# EAGLE design PI_HAT (EAGLE 9.7.0)
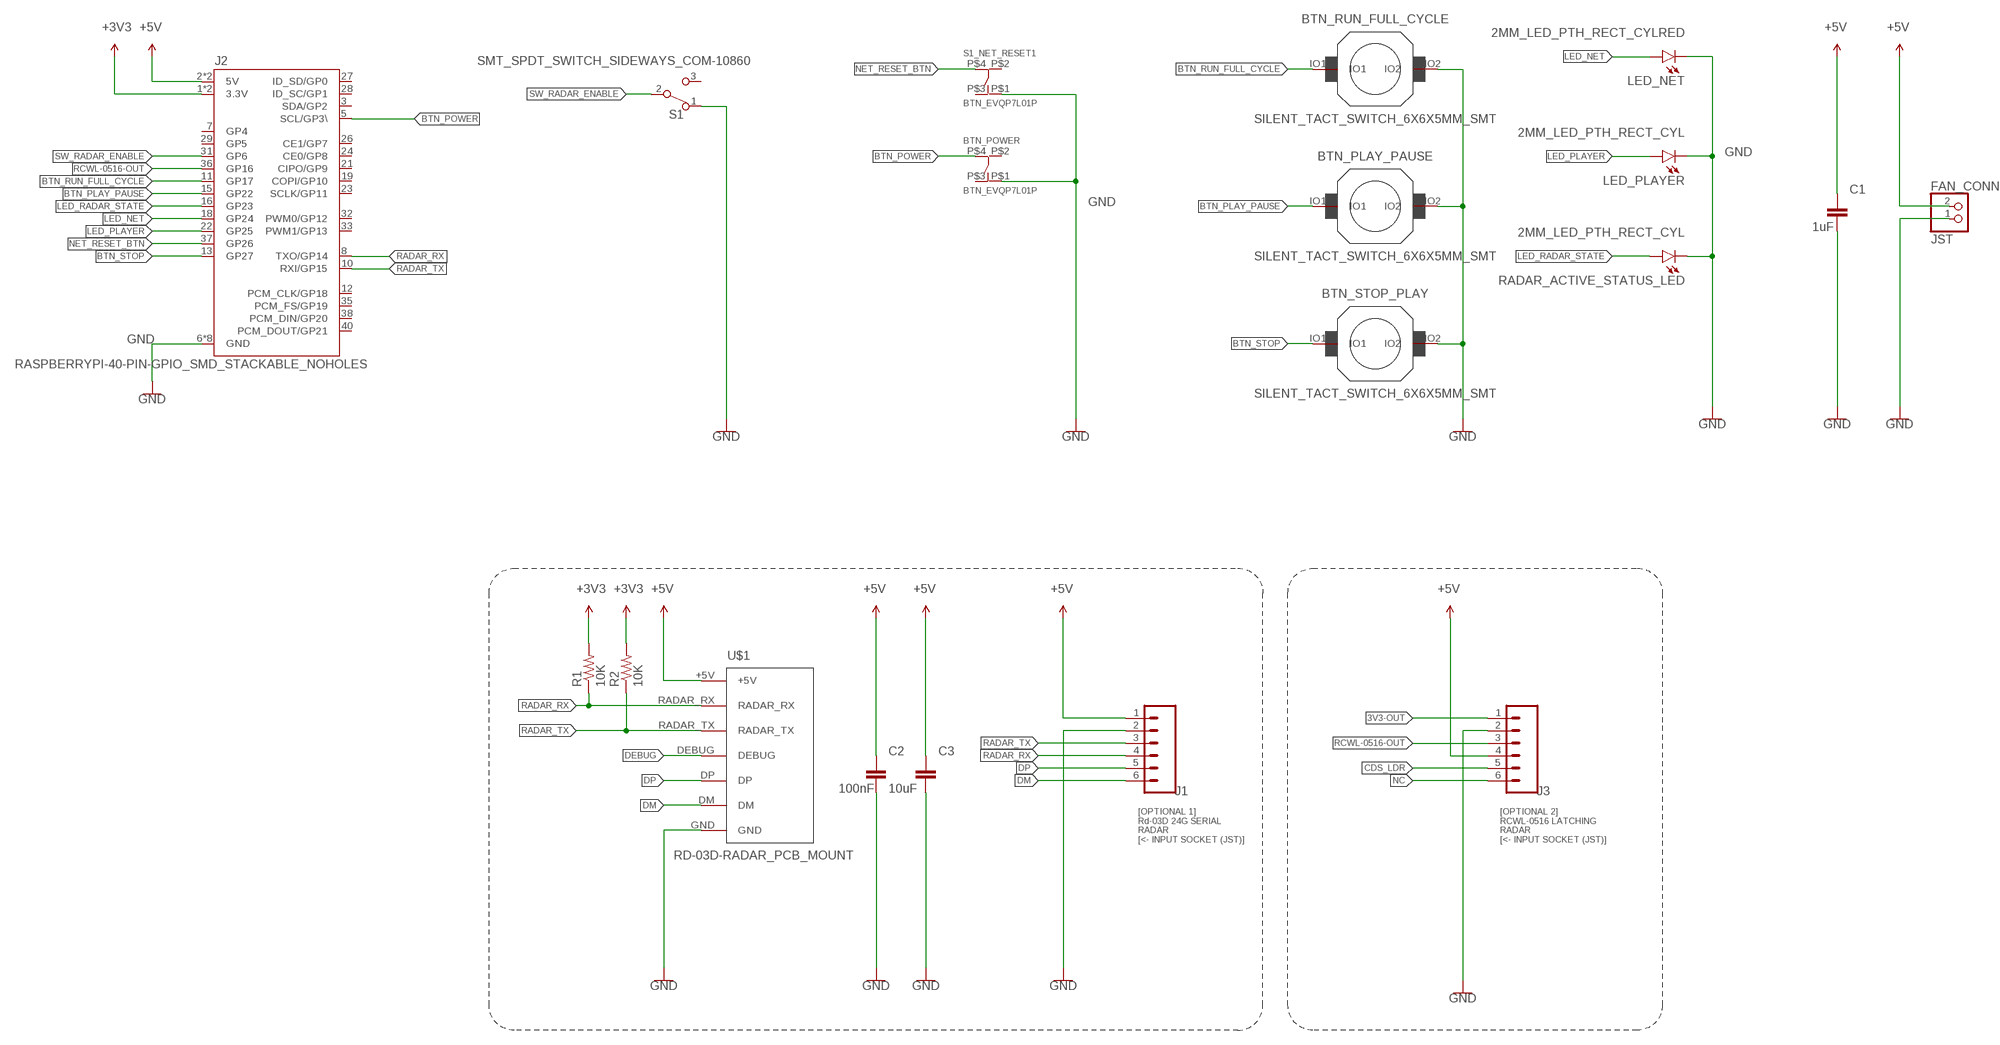
[diagram p0: schematic, sheet 1]

## Parts
BTN_PLAY_PAUSE  SILENT_TACT_SWITCH_6X6X5MM_SMT  [SILENT_TACT_SWITCH_6X6X5MM_SMT]
BTN_POWER  BTN_EVQP7L01P  [BTN_EVQP7L01P]
BTN_RUN_FULL_CYCLE  SILENT_TACT_SWITCH_6X6X5MM_SMT  [SILENT_TACT_SWITCH_6X6X5MM_SMT]
BTN_STOP_PLAY  SILENT_TACT_SWITCH_6X6X5MM_SMT  [SILENT_TACT_SWITCH_6X6X5MM_SMT]
C1  1uF  CAPACITORS_CHIP-0805(2012-METRIC)  [CAPC2012X110]
C2  100nF  CAPACITORS_CHIP-0805(2012-METRIC)  [CAPC2012X110]
C3  10uF  CAPACITORS_CHIP-0805(2012-METRIC)  [CAPC2012X110]
FAN_CONN  JST  ADAFRUIT_JST_2PIN-SMT-RA  [JST_2.5MM_SMT]
J1  JST_6PIN_1MMSMD-1MM  [JST_6PIN_1MM]
J2  RASPBERRYPI-40-PIN-GPIO_SMD_STACKABLE_NOHOLES  RASPBERRYPI-40-PIN-GPIO_PTH_REFERENCE  [RASPBERRY_PI_HAT_40_PIN_PTH_WITH_REFERNCE]
J3  JST_6PIN_1MMSMD-1MM  [JST_6PIN_1MM]
LED_NET  2MM_LED_PTH_RECT_CYLRED  [2MM_LED_PTH_RECT_CYL_RED]
LED_PLAYER  2MM_LED_PTH_RECT_CYL  [2MM_LED_PTH_RECT_CYL_YELLOW]
R1  10K  R-US_CHIP-0603(1608-METRIC)  [RESC1608X60]
R2  10K  R-US_CHIP-0603(1608-METRIC)  [RESC1608X60]
RADAR_ACTIVE_STATUS_LED  2MM_LED_PTH_RECT_CYL  [2MM_LED_PTH_RECT_CYL_YELLOW]
S1  SMT_SPDT_SWITCH_SIDEWAYS_COM-10860  [SMT_SPDT_SWITCH_SIDEWAYS]
S1_NET_RESET1  BTN_EVQP7L01P  [BTN_EVQP7L01P]
U$1  RD-03D-RADAR_PCB_MOUNT  [RD-03D-RADAR_PCB_MOUNT]

## Nets
3V3-OUT: J3.1
+3V3: J2.1(3.3V) J2.17(3.3V) R1.2 R2.2
+5V: C1.1 C2.1 C3.1 FAN_CONN.2 J1.1 J2.2(5V) J2.4(5V) J3.4 U$1.+5V
BTN_PLAY_PAUSE: BTN_PLAY_PAUSE.IO1 J2.15(GP22)
BTN_POWER: BTN_POWER.P$4 J2.5(SCL/GP3\)
BTN_RUN_FULL_CYCLE: BTN_RUN_FULL_CYCLE.IO1 J2.11(GP17)
BTN_STOP: BTN_STOP_PLAY.IO1 J2.13(GP27)
CDS_LDR: J3.5
DEBUG: U$1.DEBUG
DM: J1.6 U$1.DM
DP: J1.5 U$1.DP
GND: BTN_PLAY_PAUSE.IO2 BTN_POWER.P$1 BTN_RUN_FULL_CYCLE.IO2 BTN_STOP_PLAY.IO2 C1.2 C2.2 C3.2 FAN_CONN.1 J1.2 J2.6(GND) J2.9(GND) J2.14(GND) J2.20(GND) J2.25(GND) J2.30(GND) J2.34(GND) J2.39(GND) J3.2 LED_NET.K(CATHODE) LED_PLAYER.K(CATHODE) RADAR_ACTIVE_STATUS_LED.K(CATHODE) S1.1(NC) S1_NET_RESET1.P$1 U$1.GND
LED_NET: J2.18(GP24) LED_NET.A(ANODE)
LED_PLAYER: J2.22(GP25) LED_PLAYER.A(ANODE)
LED_RADAR_STATE: J2.16(GP23) RADAR_ACTIVE_STATUS_LED.A(ANODE)
NC: J3.6
NET_RESET_BTN: J2.37(GP26) S1_NET_RESET1.P$4
RADAR_RX: J1.4 J2.8(TXO/GP14) R1.1 U$1.RADAR_RX
RADAR_TX: J1.3 J2.10(RXI/GP15) R2.1 U$1.RADAR_TX
RCWL-0516-OUT: J2.36(GP16) J3.3
SW_RADAR_ENABLE: J2.31(GP6) S1.2(COM)
Unconnected: BTN_POWER.P$2 BTN_POWER.P$3 J2.3(SDA/GP2) J2.7(GP4) J2.12(PCM_CLK/GP18) J2.19(COPI/GP10) J2.21(CIPO/GP9) J2.23(SCLK/GP11) J2.24(CE0/GP8) J2.26(CE1/GP7) J2.27(ID_SD/GP0) J2.28(ID_SC/GP1) J2.29(GP5) J2.32(PWM0/GP12) J2.33(PWM1/GP13) J2.35(PCM_FS/GP19) J2.38(PCM_DIN/GP20) J2.40(PCM_DOUT/GP21) S1.3(NO) S1_NET_RESET1.P$2 S1_NET_RESET1.P$3

## Notes on the sheet
- [OPTIONAL 1]
  Rd-03D 24G SERIAL
  RADAR
  [<- INPUT SOCKET (JST)]
- [OPTIONAL 2]
  RCWL-0516 LATCHING
  RADAR
  [<- INPUT SOCKET (JST)]

## Library data of the parts
BTN_PLAY_PAUSE BTN_RUN_FULL_CYCLE BTN_STOP_PLAY = NewsPoet:SILENT_TACT_SWITCH_6X6X5MM_SMT: Tactile Switches WS-TASV Tact Switch 6x6x5mm SMT Mouser No: 710-430133050816 Mfr. No: 430133050816 Mfr.: Wurth Elektronik Product Link: Mouser <https://mou.sr/43FIveY>
BTN_POWER S1_NET_RESET1 = NewsPoet:BTN_EVQP7L01P
C1-C3 = NewsPoet:CAPACITORS: Capacitor - Generic; CATEGORY: Capacitor
FAN_CONN = NewsPoet:ADAFRUIT_JST_2PIN: JST 2-Pin Connectors of various flavors SMT-RA (S2B-PH-SM4) 4UConnector #17311 SMT (B2B-PH-SM4) THM-RA (S2B-PH) THM (B2B-PH)
J1 J3 = NewsPoet:JST_6PIN_1MM: JST SH Horizontal 6-Pin Connector -SMD Pin count: 6 Pin pitch: 1mm JST product name: SM06B-SRSS-TB datasheet <https://www.jst-mfg.com/product/index.php?series=231>; PROD_ID: CONN-08249; SF_ID: GPS-00579
J2 = NewsPoet:RASPBERRYPI-40-PIN-GPIO: Raspberry Pi GPIO Header 2x20 pin connector, as found on B, B+, A+ models. Both shrouded PTH and SMT versions available. SparkFun Products: GPIO Shrouded Header <https://www.sparkfun.com/products/13054>- PTH SparkFun Pi Wedge (Preassembled) <https://www.sparkfun.com/products/13717>
LED_NET LED_PLAYER RADAR_ACTIVE_STATUS_LED = NewsPoet:2MM_LED_PTH_RECT_CYL
R1 R2 = NewsPoet:R-US: Resistor Fixed - ANSI; CATEGORY: Resistor; SUB-CATEGORY: Fixed
S1 = NewsPoet:SMT_SPDT_SWITCH_SIDEWAYS: SPDT Switches; CATEGORY: Switches; DATASHEET: https://cdn.sparkfun.com/datasheets/Components/Switches/SLIDE.pdf; DESCRIPTION: Slide Switch SPDT Surface Mount & Right Angle; MANUFACTURER: SparkFun Electronics; MPN: 10860; OPERATING_TEMPERATURE: NA; PACKAGE_SIZE: NA; PACKAGE_TYPE: Surface Mount; PART_STATUS: Active; ROHS: Compliant; SERIES: NA; SUBCATEGORY: Slide Switches; TYPE: SPDT
U$1 = NewsPoet:RD-03D-RADAR_PCB_MOUNT

## Board
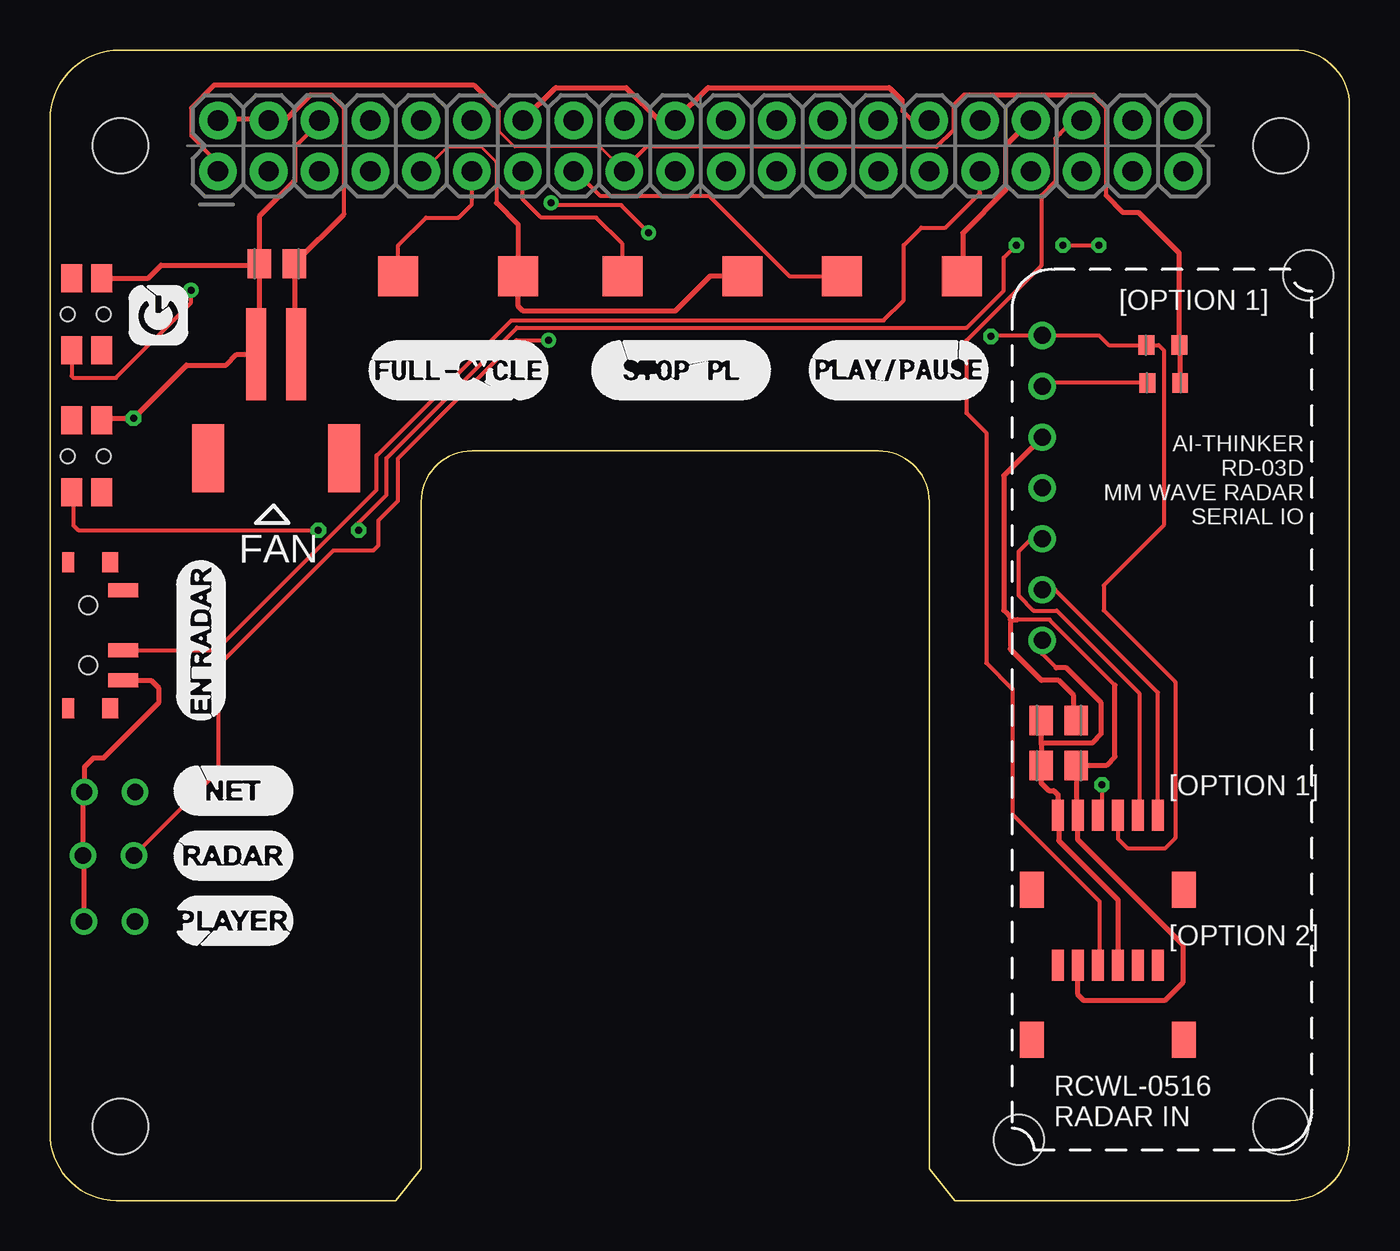
[diagram p1: board, top side]
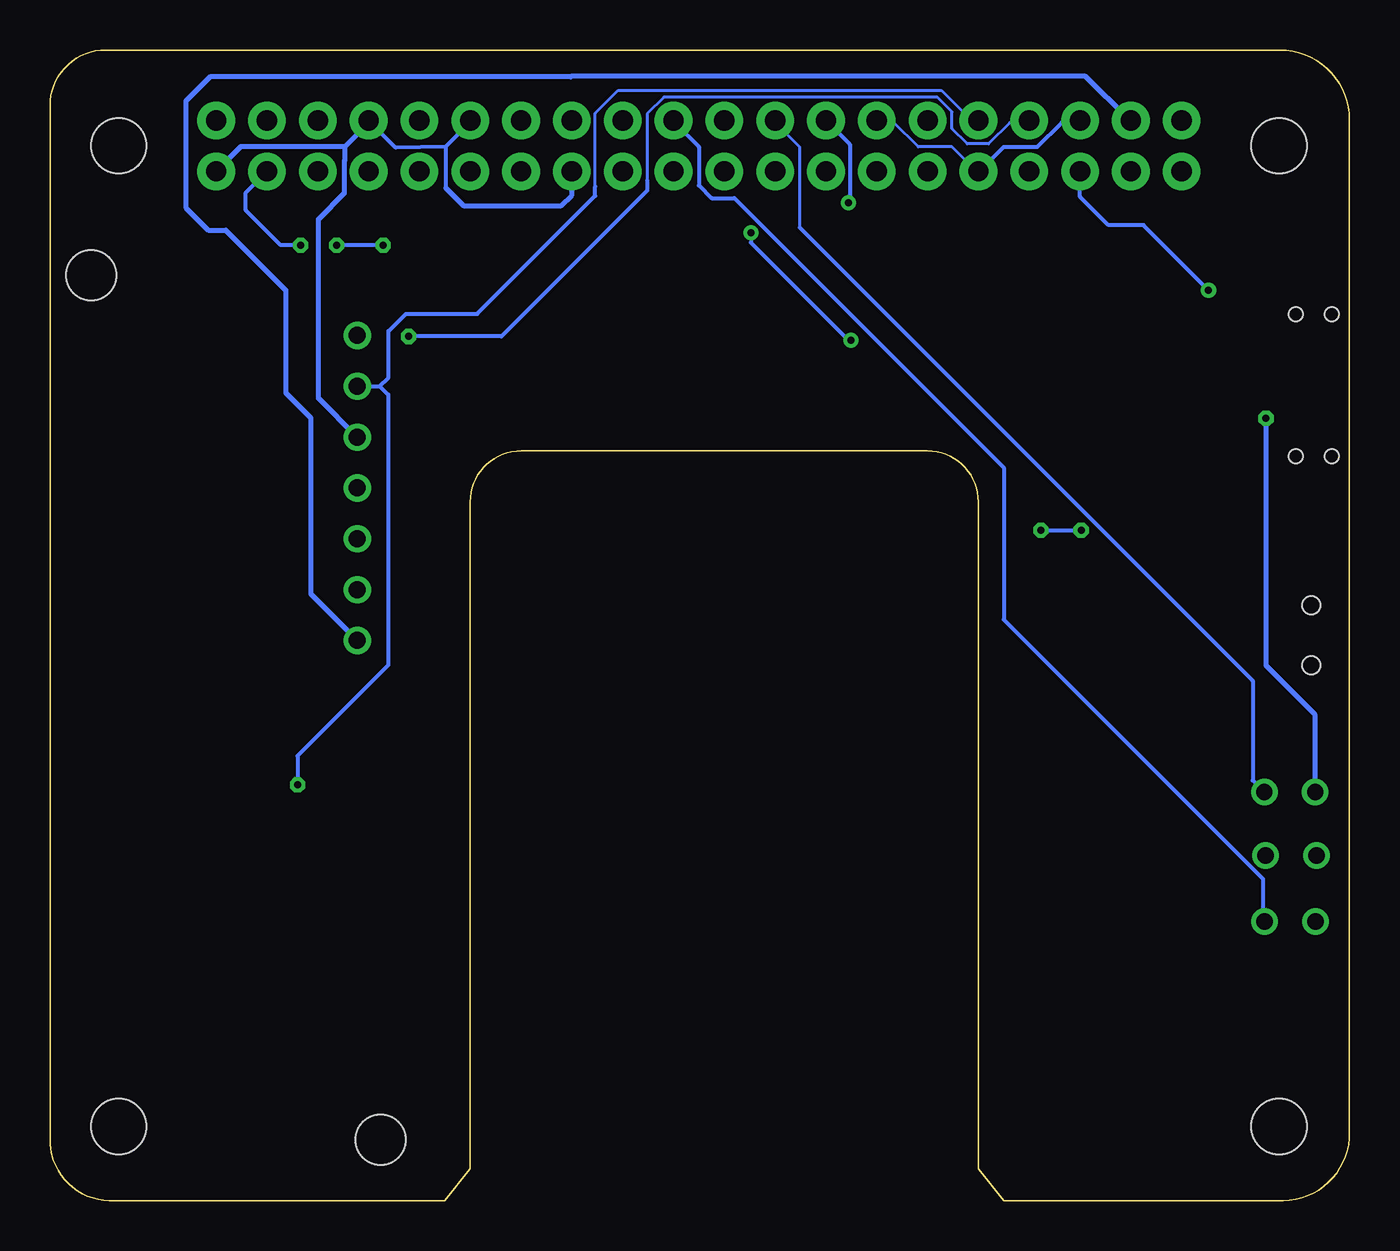
[diagram p2: board, bottom side, seen from below]

Size 64.95 x 57.5 mm. Coordinates in mm from the lower left corner, seen from the top.
Outline: 64.95,54.72 64.95,2.86 arc-90 61.71,0 45.22,0 43.95,1.59 43.95,34.93 arc90 41.41,37.47 21.09,37.47 arc90 18.55,34.93 18.55,1.59 17.28,0 3.31,0 arc-90 0,3.43 0,54.01 arc-90 3.49,57.5 62.17,57.5 arc-90 64.95,54.72
Copper layers (1*16): Top 0.035mm / dielectric 1.5mm / Bottom 0.035mm
Design rules "Fusion Electronics Design Rules - via edits.edru": minimum track width 6mil, minimum drill 0.35mm, track to track 6mil, track to pad 6mil, pad to pad 6mil, via to via 6mil, smd to smd 6mil, copper to edge 40mil, drill to drill 6mil, minimum pad ring 10mil, minimum via ring 8mil, stop-mask expansion 4mil, vias tented up to drill 16mil, thermal gap 10mil
Holes 2.5 mm at 62.9,46.25 48.42,3.06

### Footprints (pad centres in the part's own frame; a part is rotated, then mirrored left to right if it is on the bottom)
SILENT_TACT_SWITCH_6X6X5MM_SMT = smd 2 x 2: IO1 -3,0; IO2 3,0
BTN_EVQP7L01P = smd 1.4 x 1.05: P$1 -1.8,0.8; P$2 -1.8,-0.71; P$3 1.8,0.8; P$4 1.8,-0.71 | hole 0.7: 0,0.9; 0,-0.9
CAPC2012X110 = smd 1.165 x 1.465: 1 -0.875,0; 2 0.875,0
JST_2.5MM_SMT = smd 1 x 4.6: 1 1,-3.7; 2 -1,-3.7 | smd 1.6 x 3.4: NC1 -3.4,1.5; NC2 3.4,1.5
JST_6PIN_1MM = smd 0.6 x 1.55: 1 -2.54,1.27; 2 -1.54,1.27; 3 -0.54,1.27; 4 0.46,1.27; 5 1.46,1.27; 6 2.46,1.27 | smd 1.2 x 1.8: P$1 -3.84,-2.455; P$2 3.76,-2.455
RASPBERRY_PI_HAT_40_PIN_PTH_WITH_REFERNCE = drill 1.016 pad 1.88: 1 0,0; 2 0,2.54; 3 2.54,0; 4 2.54,2.54; 5 5.08,0; 6 5.08,2.54; 7 7.62,0; 8 7.62,2.54; 9 10.16,0; 10 10.16,2.54; 11 12.7,0; 12 12.7,2.54; 13 15.24,0; 14 15.24,2.54; 15 17.78,0; 16 17.78,2.54; 17 20.32,0; 18 20.32,2.54; 19 22.86,0; 20 22.86,2.54; 21 25.4,0; 22 25.4,2.54; 23 27.94,0; 24 27.94,2.54; 25 30.48,0; 26 30.48,2.54; 27 33.02,0; 28 33.02,2.54; 29 35.56,0; 30 35.56,2.54; 31 38.1,0; 32 38.1,2.54; 33 40.64,0; 34 40.64,2.54; 35 43.18,0; 36 43.18,2.54; 37 45.72,0; 38 45.72,2.54; 39 48.26,0; 40 48.26,2.54 | hole 2.75: -4.87,-47.727; 53.13,-47.727; 53.13,1.273; -4.87,1.273
2MM_LED_PTH_RECT_CYL_RED = drill 0.813: A -1.27,0; K 1.27,0
2MM_LED_PTH_RECT_CYL_YELLOW = drill 0.813: A -1.27,0; K 1.27,0
RESC1608X60 = smd 0.799 x 0.974: 1 -0.815,0; 2 0.815,0
SMT_SPDT_SWITCH_SIDEWAYS = smd 0.7 x 1.5: 1 -2.25,-1.75; 2 -0.75,-1.75; 3 2.25,-1.75 | smd 1 x 0.6: GND1 -3.65,1; GND3 3.65,1 | smd 1 x 0.8: GND2 -3.65,-1.1; GND4 3.65,-1.1 | hole 0.9: 1.5,0; -1.5,0
RD-03D-RADAR_PCB_MOUNT = drill 0.85: +5V 0,5.08; DEBUG 7.62,5.08; DM 2.54,5.08; DP 5.08,5.08; GND 10.16,5.08; RADAR_RX 15.24,5.08; RADAR_TX 12.7,5.08

### Placement (x,y rotation side)
BTN_PLAY_PAUSE  42.58,46.2 0 top
BTN_POWER  1.79,44.31 270 top
BTN_RUN_FULL_CYCLE  20.41,46.2 0 top
BTN_STOP_PLAY  31.61,46.2 0 top
C1  11.34,46.82 180 top
C2  50.42,24 0 top
C3  50.42,21.75 0 top
FAN_CONN  11.31,38.59 180 top
J1  52.92,18 0 top
J2  8.39,51.44 0 top
J3  52.92,10.5 0 top
LED_NET  2.99,20.43 180 top
LED_PLAYER  2.97,13.95 180 top
R1  55.62,42.75 0 top
R2  55.67,40.87 0 top
RADAR_ACTIVE_STATUS_LED  2.92,17.25 180 top
S1  1.92,28.25 90 top
S1_NET_RESET1  1.79,37.2 270 top
U$1  54.67,28 90 top

### Tracks (layer width: path | path; a pad name or v marks a point on that pad's centre or on a via)
+3V3
  Top 0.152: J2.17 27.49,52.66 23.22,52.66 22.46,53.42 22.46,54.46 22.17,54.75 | J2.1 8.29,51.44
  Top 0.203: 52.79,50.23 52.79,54.61 | J2.17 28.71,51.56 29.8,52.66 44.32,52.66 45.14,53.49 45.14,54.7 | 8.29,51.44 8.29,51.98 7.07,53.2 7.07,54.6
  Top 0.254: 52.79,54.61 52.15,55.25 45.7,55.25 45.14,54.7 | 52.79,50.23 53.65,49.37 54.41,49.37 56.44,47.35 R1.2 R2.2 | 7.07,54.6 8.23,55.76 21.16,55.76 22.17,54.75
+5V
  Top 0.152: 8.44,54.03 J2.2 | 10.88,54.03 J2.4 11.03,54.03 | 12.25,46.72 C1.1 12.25,46.87 | 12.25,42.3 FAN_CONN.2
  Top 0.2: 50.3,26.62 49.59,27.33 U$1.+5V
  Top 0.203: 14.69,49.31 14.69,54.61
  Top 0.254: 10.88,54.03 8.44,54.03 | 12.25,42.3 12.25,46.72 | 11.03,54.03 11.79,54.03 13.01,55.25 14.05,55.25 14.69,54.61 | 12.25,46.87 14.69,49.31 | 49.59,22.87 52.09,22.87 52.55,23.33 52.55,24.87 50.8,26.62 50.3,26.62 | J3.4 53.38,15.04 50.42,18 50.42,19.23 J1.1 50.38,20.29 50.17,20.5 49.92,20.5 49.55,20.87 C3.1 49.55,22.83 49.59,22.87 | 49.59,22.87 49.55,22.92 C2.1
  Bottom 0.152: J2.4 11.03,54.03 | 38.91,56.19 38.93,56.16
  Bottom 0.254: U$1.+5V 51.92,30.33 51.92,39.12 53.17,40.37 53.17,45.5 56.17,48.5 57.05,48.5 58.17,49.62 58.17,54.95 56.95,56.16 38.93,56.16 | 11.03,54.03 13.19,56.19 38.91,56.19
BTN_PLAY_PAUSE
  Top 0.152: J2.15 26.27,51.44
  Top 0.203: 26.27,51.44 27.49,50.22 32.95,50.22 36.97,46.2 BTN_PLAY_PAUSE.IO1
BTN_POWER  (via drill 0.35)
  Top 0.203: BTN_POWER.P$4 1.08,41.22 1.17,41.12 3.29,41.12 7.04,44.87 v7.04,45.5
  Bottom 0.203: v7.04,45.5 10.29,48.75 12.04,48.75 13.47,50.17 J2.5
BTN_RUN_FULL_CYCLE
  Top 0.203: J2.11 21.09,49.79 20.42,49.12 18.8,49.12 17.41,47.73 BTN_RUN_FULL_CYCLE.IO1
BTN_STOP
  Top 0.203: BTN_STOP_PLAY.IO1 28.61,47.81 27.3,49.12 24.55,49.12 23.63,50.04 J2.13
DM
  Top 0.203: J1.6 55.38,25.39 50.23,30.54 U$1.DM
DP
  Top 0.152: 54.44,19.33 J1.5
  Top 0.203: 54.44,19.33 54.44,25.37 50.31,29.49 49.16,29.49 48.41,30.25 48.41,32.44 49.04,33.08 U$1.DP
GND  (via drill 0.35)
  Top 0.152: 51.42,19.28 J1.2 | 45.63,46.2 BTN_PLAY_PAUSE.IO2 | 22.31,51.9 21.55,52.66 19.87,52.66 18.65,51.44 J2.9 | J2.6 13.47,53.88
  Top 0.203: 12.25,50.98 12.25,52.66 13.47,53.88 | 53.23,25.76 49.96,29.04 48.37,29.04 48,29.04 | 22.31,51.9 22.31,49.86 | J2.30 43.09,53.98 42.6,54.46 42.6,54.97 | J2.20 30.44,53.98
  Top 0.254: 48,29.04 48,27.57 49.56,26 50.42,26 51.17,25.25 51.17,24.12 C2.2 | 45.63,46.2 45.63,48.35 47.76,50.48 47.76,52.71 J2.34 | BTN_STOP_PLAY.IO2 33,46.2 31.25,44.46 23.65,44.46 23.41,44.7 BTN_RUN_FULL_CYCLE.IO2 23.41,48.76 22.31,49.86 | 30.44,53.98 28.79,55.62 25.27,55.62 J2.14 | 12.25,50.98 10.46,49.19 C1.2 10.46,46.75 | J3.2 51.38,10.29 51.67,10 55.71,10 56.62,10.9 56.62,12.8 51.37,18.05 51.37,19.33 | 51.37,19.33 51.3,19.41 C3.2 52.8,21.75 53.23,22.19 53.23,25.76 | 51.37,19.33 51.42,19.28 | U$1.GND 47.67,36.24 47.67,29.5 48.13,29.04 48.37,29.04 | LED_PLAYER.K 1.7,17.2 RADAR_ACTIVE_STATUS_LED.K 1.65,20.36 LED_NET.K 1.71,21.67 2.17,22.12 2.67,22.12 5.42,24.87 5.42,25.62 5.04,26 S1.1 | 10.46,46.75 10.46,42.44 FAN_CONN.1 9.34,42.29 8.79,41.75 6.83,41.75 v4.17,39.1 2.69,39.1 S1_NET_RESET1.P$1 | BTN_POWER.P$1 4.9,46.11 5.54,46.75 10.46,46.75 | 42.6,54.97 41.95,55.62 32.9,55.62 J2.20
  Bottom 0.152: 1.74,20.5 LED_NET.K | 43.95,53.88 J2.30 | 13.47,53.88 J2.6 | 18.5,51.44 J2.9 18.65,51.44 19.87,52.66 21.55,52.66 22.77,53.88 23.53,53.88 J2.14
  Bottom 0.203: 45.17,52.66 45.17,50.61 | 43.95,53.88 45.17,52.66 | 13.47,53.88 14.38,53.88 15.6,52.66 17.28,52.66 18.5,51.44 | 45.17,52.66 47.67,52.62 J2.34
  Bottom 0.254: J2.25 38.87,50.25 39.4,49.72 44.28,49.72 45.17,50.61 | U$1.GND 51.53,40.1 51.53,49.06 50.25,50.33 50.25,51.94 50.21,51.99 50.21,52.68 | 50.21,52.68 55.41,52.68 J2.39 | 50.21,52.68 49.03,53.85 J2.34 | v4.17,39.1 4.17,37.82 4.18,37.81 4.18,26.76 4.17,26.75 | 1.74,20.5 1.74,24.31 4.17,26.75 | 4.17,26.75
LED_NET
  Bottom 0.152: J2.18 28.71,53.88 27.49,52.66 27.49,48.63
  Bottom 0.203: 27.49,48.63 4.83,25.98 4.83,21.01 LED_NET.A
LED_PLAYER
  Bottom 0.152: J2.22 33.74,53.88
  Bottom 0.203: 33.74,53.88 32.52,52.66 32.52,50.73 31.88,50.1 30.75,50.1 17.28,36.63 17.28,29.04 4.33,16.08 4.33,14.1 LED_PLAYER.A
LED_RADAR_STATE  (via drill 0.35)
  Top 0.203: RADAR_ACTIVE_STATUS_LED.A 8.42,21.48 8.42,26.75 14.17,32.5 16.17,32.5 16.42,32.75 16.42,34 17.39,34.97 17.39,37.1 23.3,43 v24.92,43 | v29.92,48.37 28.55,49.75 25.17,49.75 v25.05,49.87
  Bottom 0.203: v24.92,43 25.05,43 29.92,47.87 v29.92,48.37 | v25.05,49.87 24.98,49.94 24.98,52.79 J2.16
NET_RESET_BTN  (via drill 0.35)
  Top 0.152: S1_NET_RESET1.P$4 1.17,35.3 | v50.63,47.74 v50.64,47.75
  Top 0.203: 1.17,35.3 1.17,33.75 1.41,33.51 v13.41,33.51 | v15.42,33.5 15.42,33.87 16.81,35.27 16.81,37.11 23.34,43.63 45.82,43.63 47.67,45.48 47.67,47.12 v48.3,47.75 | v50.64,47.75 v52.42,47.75
  Bottom 0.152: 50.62,47.75 v50.63,47.74 | v13.42,33.5 v13.41,33.51
  Bottom 0.203: v15.42,33.5 v13.42,33.5 | v52.42,47.75 53.42,47.75 55.17,49.5 55.17,50.38 J2.37 | v48.3,47.75 50.62,47.75
RADAR_RX  (via drill 0.35)
  Top 0.152: R1.1 54.77,42.75 | 53.4,19.13 J1.4
  Top 0.203: 53.4,19.13 53.4,18.08 53.88,17.59 55.71,17.59 56.24,18.12 56.24,25.93 52.67,29.5 52.67,30.75 55.67,33.75 55.67,42.5 55.42,42.75 R1.1 | 54.77,42.75 52.92,42.75 52.43,43.24 U$1.RADAR_RX 47.08,43.24 v47.02,43.19
  Bottom 0.152: J2.8 16.06,53.88 16.98,53.88 18.04,52.81 19.11,52.81 19.87,53.57 19.87,54.41 20.61,55.15 34.27,55.15 35.11,54.31 35.11,50.98
  Bottom 0.203: 35.11,50.98 35.11,50.47 42.39,43.19 v47.02,43.19
RADAR_TX  (via drill 0.35)
  Top 0.203: v52.58,20.78 52.58,19.47 J1.3 | R2.1 49.77,40.87 U$1.RADAR_TX
  Bottom 0.152: 37.7,50.68 37.7,54.34 36.56,55.48 20.4,55.48 18.96,54.03 18.65,54.03 J2.10
  Bottom 0.203: v52.58,20.78 52.58,22.23 48.05,26.76 48.05,40.28 48.47,40.7 | U$1.RADAR_TX 48.47,40.7 | 37.7,50.68 37.7,50.22 43.6,44.32 47.16,44.32 48.03,43.45 48.03,41.14 48.47,40.7
RCWL-0516-OUT
  Top 0.2: 52.46,11.85 J3.3
  Top 0.203: 52.46,11.85 52.46,14.96 48.11,19.31 48.11,25.56 46.8,26.87 46.8,38.37 45.8,39.37 45.8,42.98 49.55,46.73 49.55,50.23 50.25,50.93 50.25,53.08 50.48,53.31 51.15,53.98 J2.36
SW_RADAR_ENABLE
  Top 0.152: S1.2 3.72,27.51
  Top 0.203: 3.72,27.51 8.31,27.51 16.31,35.52 16.31,37.24 23.06,43.99 41.66,43.99 42.67,45 42.67,47.75 43.55,48.62 44.76,48.62 46.49,50.35 J2.31

### Text on the board
tPlace: [OPTION 1] | AI-THINKER / RD-03D / MM WAVE RADAR / SERIAL IO | FAN | [OPTION 1] | [OPTION 2] | RCWL-0516 / RADAR IN